# EAGLE design EMS esp32 wifi lora gsm v2.6 (EAGLE 9.5.2)
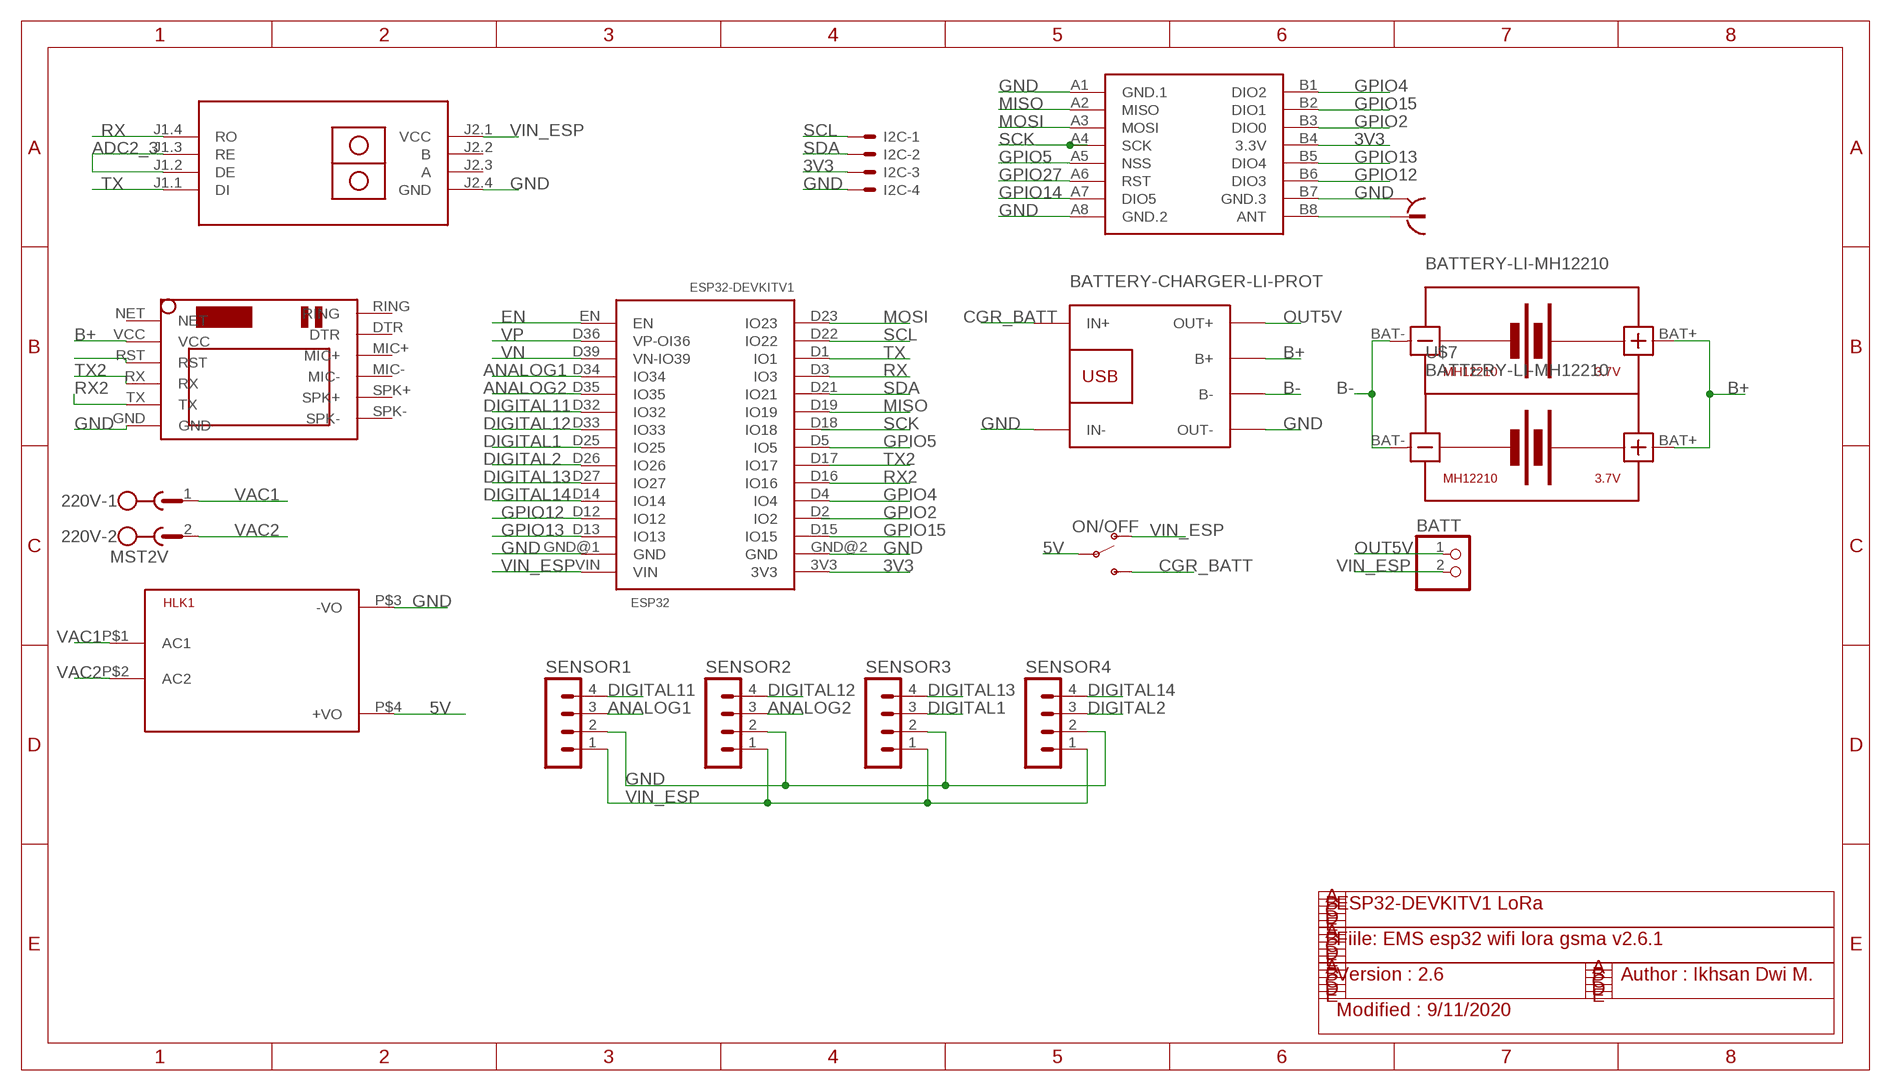
[diagram p0: schematic, sheet 1]

## Parts
220V  MST2V  [MSTBV2]
BATT  PINHD-1X2  [1X02]
ESP32  ESP32DEVKITV1  [ESP32-DEVKITV1]
HLK1  HLK-PM013W  [HLK-PM01]
I2C  22-23-2041  [22-23-2041]
ON/OFF  SWITCH-SPDT-PTH-11.6X4.0MM  [SWITCH_SPDT_PTH_11.6X4.0MM]
SENSOR1  MA04-1  [MA04-1]
SENSOR2  MA04-1  [MA04-1]
SENSOR3  MA04-1  [MA04-1]
SENSOR4  MA04-1  [MA04-1]
U$1  RS485-TTL-CONVERTER  [RS485-TTL-CONVERTER]
U$5  WIRELESS-LORA-RFM95W#SMD  [WIRELESS-LORA-RFM95W#SMD]
U$6  BATTERY-LI-MH12210  [BATTERY-LI-MH12210]
U$7  BATTERY-LI-MH12210  [BATTERY-LI-MH12210]
U$8  BATTERY-CHARGER-LI-PROT  [BATTERY-CHARGER-LI-PROT]
U$9  SIM800LMODULE  [SIM800LMODULE]
X1  734120110  [734120110]

## Nets
3V3: ESP32.3V3 I2C.3 U$5.B4(3.3V)
5V [usbvcc]: HLK1.P$4(+VO) ON/OFF.2(P)
ADC2_3: U$1.J1.2(DE) U$1.J1.3(RE)
ANALOG1: ESP32.D34(IO34) SENSOR1.3
ANALOG2: ESP32.D35(IO35) SENSOR2.3
B+: U$6.BAT+ U$7.BAT+ U$8.B+ U$9.VCC
B-: U$6.BAT- U$7.BAT- U$8.B-
CGR_BATT [usbvcc]: ON/OFF.3(S) U$8.IN+
DIGITAL1: ESP32.D25(IO25) SENSOR3.3
DIGITAL2: ESP32.D26(IO26) SENSOR4.3
DIGITAL11: ESP32.D32(IO32) SENSOR1.4
DIGITAL12: ESP32.D33(IO33) SENSOR2.4
DIGITAL13: ESP32.D27(IO27) SENSOR3.4
DIGITAL14: ESP32.D14(IO14) SENSOR4.4
EN: ESP32.EN
GND: ESP32.GND@1(GND) ESP32.GND@2(GND) HLK1.P$3(-VO) I2C.4 SENSOR1.2 SENSOR2.2 SENSOR3.2 SENSOR4.2 U$1.J2.4(GND) U$5.A1(GND.1) U$5.A8(GND.2) U$5.B7(GND.3) U$8.IN- U$8.OUT- U$9.GND X1.S@1 X1.S@2 X1.S@3
GPIO2: ESP32.D2(IO2) U$5.B3(DIO0)
GPIO4: ESP32.D4(IO4) U$5.B1(DIO2)
GPIO5: ESP32.D5(IO5) U$5.A5(NSS)
GPIO12: ESP32.D12(IO12) U$5.B6(DIO3)
GPIO13: ESP32.D13(IO13) U$5.B5(DIO4)
GPIO14: U$5.A7(DIO5)
GPIO15: ESP32.D15(IO15) U$5.B2(DIO1)
GPIO27: U$5.A6(RST)
MISO: ESP32.D19(IO19) U$5.A2(MISO)
MOSI: ESP32.D23(IO23) U$5.A3(MOSI)
N$2: U$9.RST
N$8: U$5.B8(ANT) X1.1
OUT5V [usbvcc]: BATT.1 U$8.OUT+
RX: ESP32.D3(IO3) U$1.J1.4(RO)
RX2: ESP32.D16(IO16) U$9.TX
SCK: ESP32.D18(IO18) U$5.A4(SCK)
SCL: ESP32.D22(IO22) I2C.1
SDA: ESP32.D21(IO21) I2C.2
TX: ESP32.D1(IO1) U$1.J1.1(DI)
TX2: ESP32.D17(IO17) U$9.RX
VAC1: 220V.1 HLK1.P$1(AC1)
VAC2: 220V.2 HLK1.P$2(AC2)
VIN_ESP [usbvcc]: BATT.2 ESP32.VIN ON/OFF.1(O) SENSOR1.1 SENSOR2.1 SENSOR3.1 SENSOR4.1 U$1.J2.1(VCC)
VN: ESP32.D39(VN-IO39)
VP: ESP32.D36(VP-OI36)
Unconnected: U$1.J2.2(B) U$1.J2.3(A) U$9.DTR U$9.MIC+ U$9.MIC- U$9.NET U$9.RING U$9.SPK+ U$9.SPK-

## Notes on the sheet
- ESP32-DEVKITV1 LoRa
- Fiile: EMS esp32 wifi lora gsma v2.6.1
- Version : 2.6 | Author : Ikhsan Dwi M.
- Modified : 9/11/2020

## Library data of the parts
220V = con-phoenix-508:MST2V: PHOENIX; OC_FARNELL: unknown; OC_NEWARK: unknown
BATT = pinhead:PINHD-1X2: PIN HEADER
ESP32 = ESP32-DEVKITV1:ESP32DEVKITV1
HLK1 = HLK-PM01:HLK-PM01: Hi-Link Power Supply HLK-PM01 3W Author: Ahmed Said <https://github.com/AhmedSaid/EAGLELibraries>
I2C = con-molex:22-23-2041: .100" (2.54mm) Center Header - 4 Pin; MF: MOLEX; MPN: 22-23-2041; OC_FARNELL: 1462920; OC_NEWARK: 38C0355
ON/OFF = SparkFun-Switches:SWITCH-SPDT: Single Pole, Double Throw (SPDT) Switch Single-pole, double-throw (SPDT) switch. Variant Overview SMD-AYZ0202 Surface Mount DPDT Switch <https://www.sparkfun.com/products/597> (COM-00597) Used on e.g. LilyPad Arduino USB - ATmega32U4 Board <https://www.sparkfun.com/products/12049> PTH-11.6X4.0MM SPDT Mini Power Switch <https://www.sparkfun.com/products/102> (COM-00102) Used on e.g. SparkFun Simon Says - Through-Hole Soldering Kit <https://www.sparkfun.com/products/10547> (KIT-10547) PTH-11.6X4.0MM-KIT KIT version of SPDT Mini Power Switch - Simplifies soldering by removing tStop of switch pins - only one side can be soldered. PTH-11.6X4.0MM-LOCK LOCK version of SPDT Mini Power Switch - Offset pins hold switch in place for easier soldering. SMD-RIGHT-ANGLE Surface Mount Right Angle Switch <https://www.sparkfun.com/products/10860> (COM-10860) Used on e.g. SparkFun ESP8266 Thing <https://www.sparkfun.com/products/13231>; PROD_ID: SWCH-08261; SF_SKU: COM-00102
SENSOR1-SENSOR4 = con-lstb:MA04-1: PIN HEADER; OC_FARNELL: unknown; OC_NEWARK: unknown
U$1 = diy-modules:RS485-TTL-CONVERTER: RS485 to TTL converter based on MAX485 chip
U$5 = diy-modules:WIRELESS-LORA-RFM95W: 868/915 MHz LoRa Radio Transceiver Module based on SX1276 chip Click here to find device on ebay.com <http://www.ebay.com/sch/RFM95W+transceiver>
U$6 U$7 = diy-modules:BATTERY-LI-MH12210: Lithium-Ion MH12210 Rechargeable Battery Panasonic NCR18650PF battery datasheet available here: https://industrial.panasonic.com/cdbs/www-data/pdf2/ACI4000/ACI4000C12.pdf Click here to find device on ebay.com <http://www.ebay.com/sch/ncr18650b+battery>
U$8 = diy-modules:BATTERY-CHARGER-LI-PROT: Lithium Battery 5V Charger with protection circuit More details available here: http://www.instructables.com/id/DIY-Lithium-ion-Battery-Charger/step4/TP4056-based-lithium-ion-battery-charger-module/ Click here to find device on ebay.com <http://www.ebay.com/sch/tp4056+charger+usb+protection>
U$9 = SIM800LMODULE:SIM800LMODULE: SIM800L Module
X1 = con-coax:734120110: MICRO COAXIAL CONNECTOR RECEPTACLE VERTICAL Source: Data sheet <http://www.molex.com/pdm_docs/sd/734120110_sd.pdf>

## Net classes
1 power: width 0.61 mm, drill 0.508 mm, clearance 0.152 mm
2 gnd: width 0.305 mm, drill 0.508 mm, clearance 0.152 mm
3 usbvcc: width 0.508 mm, drill 0.508 mm, clearance 0.152 mm

## Board
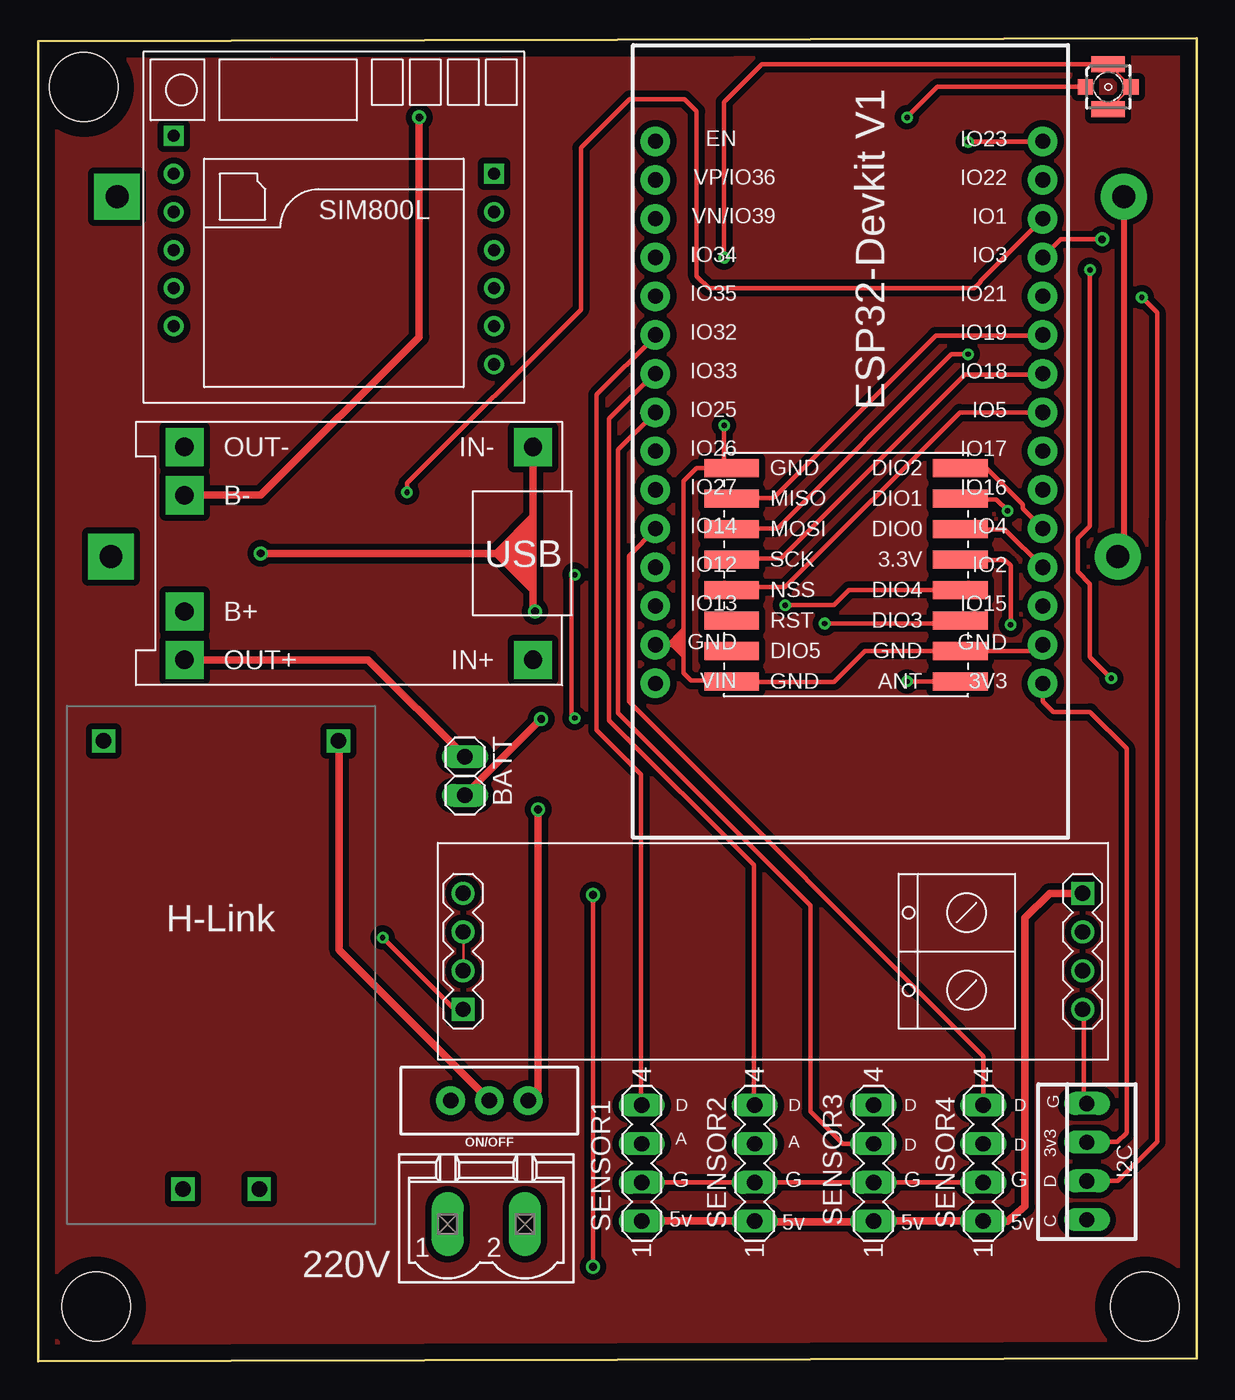
[diagram p1: board, top side]
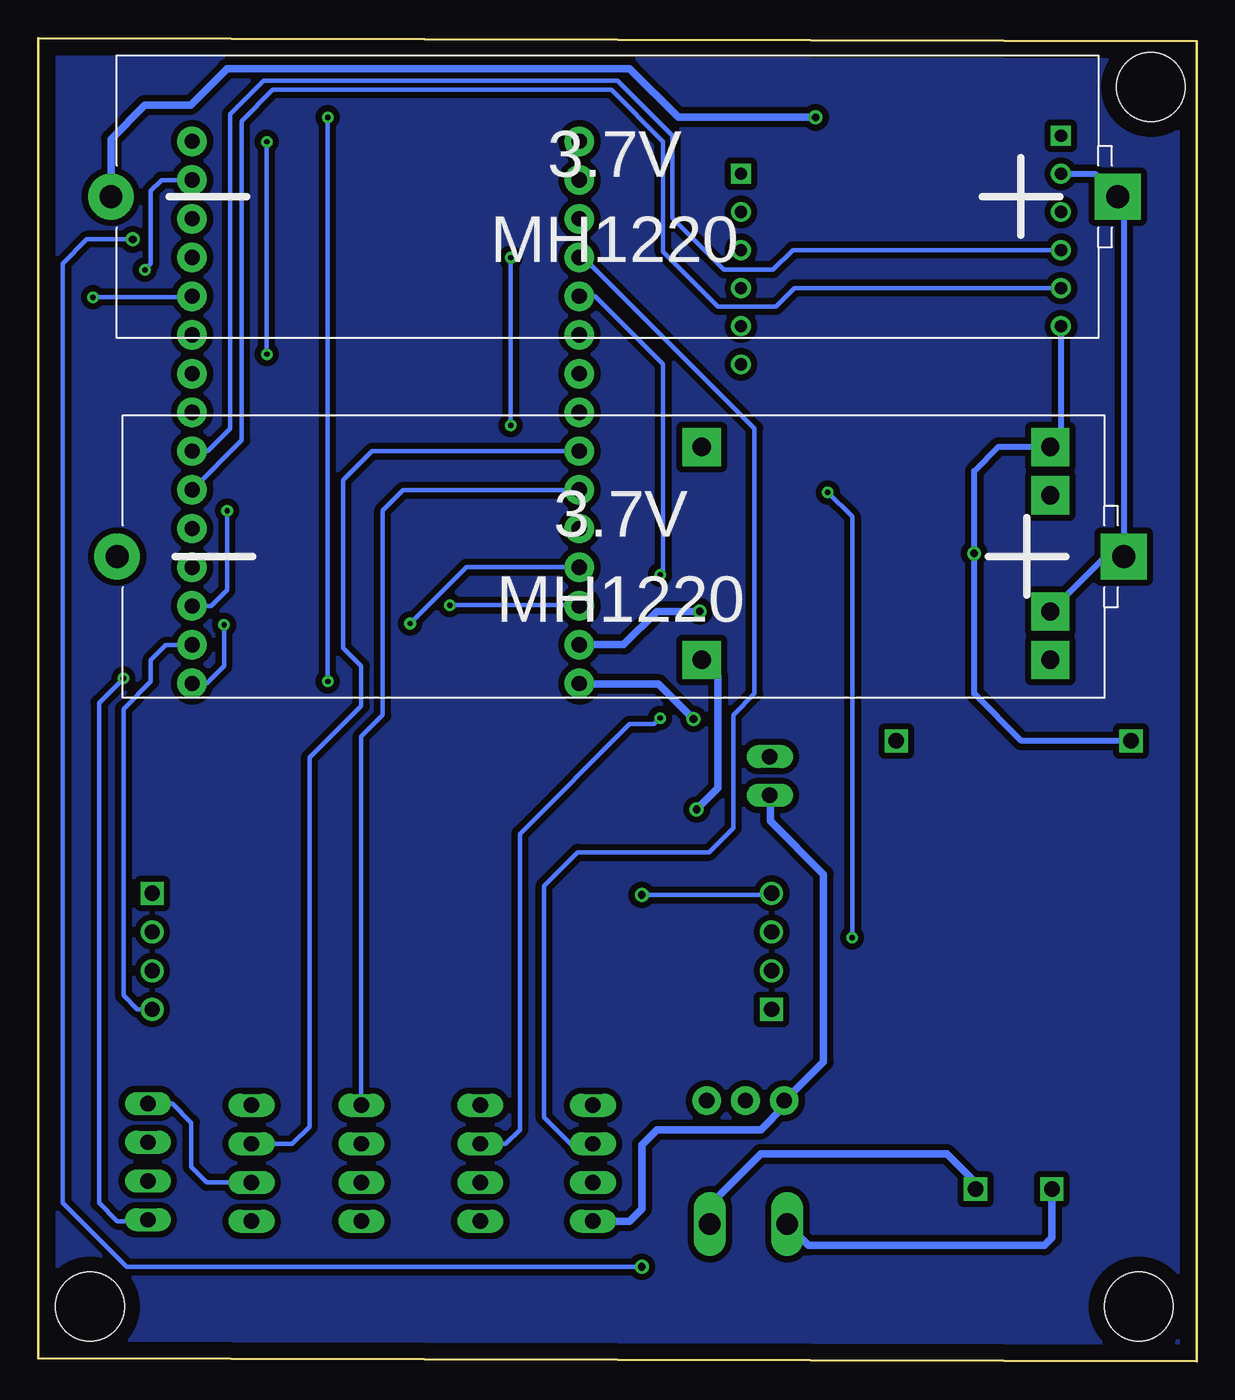
[diagram p2: board, bottom side, seen from below]

Size 76 x 86.8 mm. Coordinates in mm from the lower left corner, seen from the top.
Outline: 0,86.6 76,86.8 76,0.2 0,0 0,86.6
Copper layers (1*16): Top 0.035mm / dielectric 1.5mm / Bottom 0.035mm
Design rules "default": minimum track width 6mil, minimum drill 0.35mm, track to track 6mil, track to pad 6mil, pad to pad 6mil, via to via 6mil, smd to smd 6mil, copper to edge 40mil, drill to drill 6mil, minimum pad ring 10mil, minimum via ring 8mil, stop-mask expansion 4mil, vias tented up to drill 0mil, thermal gap 10mil
Holes 4.5 mm at 3.8,3.6 72.6,3.6 3,83.6

### Footprints (pad centres in the part's own frame; a part is rotated, then mirrored left to right if it is on the bottom)
MSTBV2 = drill 1.397 long: 1 -2.54,0; 2 2.54,0
1X02 = drill 1.016 long: 1 -1.27,0; 2 1.27,0
ESP32-DEVKITV1 = drill 1 pad 1.93: 3V3 -16.52,-12.27; D1 13.96,-12.27; D2 -8.9,-12.27; D3 11.42,-12.27; D4 -6.36,-12.27; D5 1.26,-12.27; D12 -8.9,13.135; D13 -11.44,13.135; D14 -6.36,13.135; D15 -11.44,-12.27; D16 -3.82,-12.27; D17 -1.28,-12.27; D18 3.8,-12.27; D19 6.34,-12.27; D21 8.88,-12.27; D22 16.5,-12.27; D23 19.04,-12.27; D25 1.26,13.135; D26 -1.28,13.135; D27 -3.82,13.135; D32 6.34,13.135; D33 3.8,13.135; D34 11.42,13.135; D35 8.88,13.135; D36 16.5,13.135; D39 13.96,13.135; EN 19.04,13.135; GND@1 -13.98,13.135; GND@2 -13.98,-12.27; VIN -16.52,13.135
HLK-PM01 = drill 1.016 square: P$1 -14.7,2.5; P$2 -14.7,-2.5; P$3 14.7,7.7; P$4 14.7,-7.7
22-23-2041 = drill 1 long: 1 -3.81,0; 2 -1.27,0; 3 1.27,0; 4 3.81,0
SWITCH_SPDT_PTH_11.6X4.0MM = drill 1.016 pad 1.88: 1 0,2.54; 2 0,0; 3 0,-2.54
MA04-1 = drill 1.016 long: 1 -3.81,0; 2 -1.27,0; 3 1.27,0; 4 3.81,0
RS485-TTL-CONVERTER = drill 1 square: J1.1 -20.32,-3.81; J2.1 20.32,3.81 | drill 1: J1.2 -20.32,-1.27; J1.3 -20.32,1.27; J1.4 -20.32,3.81; J2.2 20.32,1.27; J2.3 20.32,-1.27; J2.4 20.32,-3.81
WIRELESS-LORA-RFM95W#SMD = smd 3.6 x 1.2: A1 -7.5,7; A2 -7.5,5; A3 -7.5,3; A4 -7.5,1; A5 -7.5,-1; A6 -7.5,-3; A7 -7.5,-5; A8 -7.5,-7; B1 7.5,7; B2 7.5,5; B3 7.5,3; B4 7.5,1; B5 7.5,-1; B6 7.5,-3; B7 7.5,-5; B8 7.5,-7
BATTERY-LI-MH12210 = drill 1.5 pad 3 square: BAT+ -33.02,0 | drill 1.5 pad 3: BAT- 33.02,0
BATTERY-CHARGER-LI-PROT = drill 1.2 pad 2.5 square: B+ 10.795,3.81; B- 10.795,-3.81; IN+ -12.065,6.985; IN- -12.065,-6.985; OUT+ 10.795,6.985; OUT- 10.795,-6.985
SIM800LMODULE = drill 0.8: DTR 10.5,1; GND -10.5,-6.5; MIC+ 10.5,-1.5; MIC- 10.5,-4; RST -10.5,1; RX -10.5,-1.5; SPK+ 10.5,-6.5; SPK- 10.5,-9; TX -10.5,-4; VCC -10.5,3.5 | drill 0.8 square: NET -10.5,6; RING 10.5,3.5
734120110 = smd 1 x 1: 1 0,-1.5; S@1 0,1.5 | smd 1.05 x 2.2: S@2 -1.475,0; S@3 1.475,0

### Placement (x,y rotation side)
220V  29.4,9 0 top
BATT  28,38.4 270 top
ESP32  53.63,60.99 90 top
HLK1  12,26 90 top
I2C  68.8,13.1 90 top
ON/OFF  29.6,17.1 90 top
SENSOR1  39.6,13 90 top
SENSOR2  47,13 90 top
SENSOR3  54.8,13 90 top
SENSOR4  62,13 90 top
U$1  48.2,26.9 0 top
U$5  53,51.6 0 top
U$6  37.8,52.8 180 bottom
U$7  38.2,76.4 180 bottom
U$8  20.4,53 180 top
U$9  19.4,74.4 0 top
X1  70.2,83.6 270 top

### Tracks (layer width: path | path; a pad name or v marks a point on that pad's centre or on a via)
3V3  (via drill 0.35)
  Top 0.152: 65.87,44.54 ESP32.3V3 | 68.82,14.4 I2C.3 | 60.8,52.58 60.51,52.58 U$5.B4
  Top 0.305: v63.8,48.31 63.8,52.2 63.42,52.58 60.8,52.58 | ESP32.3V3 65.9,43.3 66.6,42.6 69,42.6 71.4,40.2 71.4,15 70.8,14.4 68.82,14.4
  Bottom 0.305: ESP32.3V3 64.93,44.47 63.8,45.6 v63.8,48.31
5V
  Top 0.508: HLK1.P$4 19.75,40.69 19.75,26.98 29.58,17.15 ON/OFF.2
ADC2_3
  Top 0.152: U$1.J1.2 27.9,25.68 27.9,28.12 U$1.J1.3
ANALOG1
  Top 0.152: 40.42,72.43 ESP32.D34
  Bottom 0.305: SENSOR1.3 40.93,14.27 41,14.2 42.8,16 42.8,31.2 40.6,33.4 32,33.4 30.4,35 30.4,42.4 29,43.8 29,61.2 40.21,72.41 ESP32.D34
ANALOG2  (via drill 0.35)
  Top 0.152: 40.42,69.91 ESP32.D35
  Top 0.305: v35.2,42.2 35,42.4 35,51.4 v35.2,51.6
  Bottom 0.305: SENSOR2.3 45.33,14.27 44.4,15.2 44.4,34.6 37.2,41.8 35.6,41.8 v35.2,42.2 | v35.2,51.6 35,51.8 35,65.4 39.47,69.87 ESP32.D35
B
  pour Bottom (isolate 0.406): 0.6,85.8 75.2,85.8 75.2,0.8 0.8,0.8 0.8,85.6
B+
  Bottom 0.406: U$8.B+ 6,52.8 U$6.BAT+ 4.78,76 U$7.BAT+ 6.68,77.9 U$9.VCC
B-  (via drill 0.51)
  Top 0.406: U$7.BAT- 71.22,53.2 U$6.BAT-
  Top 0.508: U$8.B- 14.61,56.81 25,67.2 v25,81.6
  Bottom 0.508: v25,81.6 34,81.6 37.2,84.8 63.6,84.8 66,82.4 69,82.4 71.22,80.18 U$7.BAT-
CGR_BATT  (via drill 0.51)
  Top 0.508: v32.8,36.2 32.8,17.76 ON/OFF.3
  Bottom 0.508: U$8.IN+ 31.4,44.95 31.4,37.6 v32.8,36.2
DIGITAL1
  Top 0.152: 40.42,62.29 ESP32.D25 | 52.8,14.27 52.76,14.27 52.71,14.31 50.65,16.38 50.65,16.4 | 38.04,42.6 38.04,42.52
  Top 0.305: 39.6,62.2 40.45,62.2 ESP32.D25 38.04,59.8 38.04,42.6 | 38.04,42.52 50.65,29.91 50.65,16.4 52.76,14.29 52.76,14.27 | 52.8,14.27 SENSOR3.3
DIGITAL2
  Top 0.152: 40.42,59.78 ESP32.D26
  Bottom 0.305: SENSOR4.3 59.33,14.27 58.2,15.4 58.2,39.6 54.8,43 54.8,45.6 56,46.8 56,57.8 54.09,59.71 ESP32.D26
DIGITAL11
  Top 0.152: 40.42,67.4 ESP32.D32 | 39.56,16.84 SENSOR1.4
  Top 0.305: ESP32.D32 40.5,67.26 36.63,63.4 36.63,41.42 39.56,38.49 39.56,16.84
DIGITAL12
  Top 0.152: 40.42,64.81 ESP32.D33 40.4,64.77
  Top 0.305: SENSOR2.4 46.95,16.86 46.95,32.56 37.45,42.05 37.45,61.83 40.4,64.77
DIGITAL13
  Top 0.152: 40.42,57.19 ESP32.D27
  Bottom 0.152: 40.55,57.15 ESP32.D27
  Bottom 0.305: 40.55,57.15 52.05,57.15 53.4,55.8 53.4,42.4 54.8,41 SENSOR3.4
DIGITAL14
  Top 0.152: 40.42,54.67 ESP32.D14 | 38.75,43.27 38.81,43.21
  Top 0.305: ESP32.D14 40.5,54.58 38.75,52.84 38.75,43.27 | 38.81,43.21 62,20.02 SENSOR4.4
EN
  Top 0.152: 40.42,80.05 ESP32.EN
GND  (via drill 0.35, 0.51)
  Top 0.152: 40.42,47.05 ESP32.GND@1 | SENSOR2.2 | 68.59,23.09 U$1.J2.4 | 55,11.74 54.87,11.74 SENSOR3.2 | 44.4,44.65 45.43,44.65 U$5.A8 45.58,44.58 45.8,44.58 | X1.S@2 70.27,85.04 71.64,83.67 X1.S@1 71.71,83.59 70.27,82.14 X1.S@3 | 65.92,47.02 ESP32.GND@2 65.86,46.95 65.85,46.94 | 60.51,46.63 U$5.B7
  Top 0.305: 45.8,44.58 52.2,44.58 54.22,46.6 U$5.B7 65.5,46.6 65.86,46.95 | 42.2,46.4 41.6,47 ESP32.GND@1 41.35,47.01 41.47,47.13 | 42.2,46.4 42.34,46.26 | 42.34,46.26 42.34,45.14 42.83,44.65 44.4,44.65 | U$5.A1 45.2,58.6 | 45.2,58.6 43.2,58.6 42.34,57.74 42.34,48 | 42.34,48 42.34,47.2 | 42.34,47.2 42.34,46.26 | 41.47,47.13 42.07,47.73 | 42.07,47.73 42.34,48 | 41.47,47.13 41.8,47.13 | 41.8,47.13 42.27,47.13 42.34,47.2 | 42.07,47.73 42.2,47.6 42.2,47.4 | 42.2,47.4 42.2,46.73 | 42.2,46.73 42.2,46.4 | 41.8,47.13 42.07,47.4 42.2,47.4 | 41.8,47.13 42.2,46.73 | X1.S@2 47.48,85.07 45,82.6 v45,72.4 | v45,61.4 45,58.8 45.2,58.6 | I2C.4 68.59,17.12 68.59,23.09 | SENSOR4.2 55.01,11.73 55,11.74 | SENSOR3.2 SENSOR2.2 | SENSOR1.2 SENSOR2.2
  Top 0.508: 31.98,59.99 U$8.IN- 32.47,55.4 | 32.47,55.4 32.47,54.8 | 32.47,54.8 32.47,54.2 | 32.47,54.2 32.47,53.6 | 32.47,53.6 32.47,53 | 32.47,53 32.47,52.4 | 32.47,52.4 32.47,51.8 | 32.47,51.8 32.47,51.2 | 32.47,51.2 32.47,50.6 | 32.47,50.6 32.47,49.34 v32.6,49.2 | v14.6,53 30.2,53 | 32.47,53 31.8,53 | 31.8,53 31.26,53 | 30.67,53 31.2,53 | 32.47,54.8 30.67,53 | 30.67,53 30.2,53 | 32.47,55.4 30.2,53.13 30.2,53 | 30.2,53 30.2,52.87 32.47,50.6 | 30.67,53 32.47,51.2 | 31.2,53 32.4,51.8 32.47,51.8 | 31.8,53 32.4,52.4 32.47,52.4 | 31.2,53 31.26,53 | 31.26,53 32.47,54.2 | 31.8,53 32.4,53.6 32.47,53.6
  Bottom 0.152: 65.87,46.98 ESP32.GND@2 65.92,46.94
  Bottom 0.305: v45,72.4 v45,61.4 | I2C.4 67.21,16.91 65.95,15.65 65.95,12.75 64.93,11.73 SENSOR4.2 | U$1.J2.4 69.49,23.09 70.4,24 70.4,42.8 68.6,44.6 68.6,46 67.62,46.98 65.87,46.98
  Bottom 0.406: U$9.GND 8.9,60.69 U$8.OUT- | U$8.OUT- | HLK1.P$3 11.5,40.7 14.6,43.8 v14.6,53 14.6,58.4 13,59.99 U$8.OUT-
  Bottom 0.508: v32.6,49.2 35.4,49.2 37.59,47.01 ESP32.GND@1
GPIO2
  Top 0.152: 62,54.56 60.51,54.56 U$5.B3
  Top 0.305: ESP32.D2 63.43,54.56 62,54.56
GPIO4
  Top 0.305: ESP32.D4 64.6,55.93 64.6,56.2 62.2,58.6 U$5.B1
GPIO5
  Top 0.305: U$5.A5 45.7,50.8 49,50.8 60.45,62.25 ESP32.D5
GPIO12  (via drill 0.35)
  Top 0.152: 40.42,52.16 ESP32.D12
  Top 0.305: U$5.B6 60.3,48.4 v51.6,48.4
  Bottom 0.305: v51.6,48.4 47.91,52.09 ESP32.D12
GPIO13  (via drill 0.35)
  Top 0.152: 40.42,49.57 ESP32.D13
  Top 0.305: U$5.B5 53.2,50.6 52.2,49.6 v49,49.6
  Bottom 0.305: v49,49.6 40.55,49.6 ESP32.D13
GPIO15  (via drill 0.35)
  Top 0.152: 62.27,56.54 61.6,56.54 60.51,56.54 U$5.B2
  Top 0.305: v63.6,55.8 62.86,56.54 61.6,56.54
  Bottom 0.305: ESP32.D15 64.65,49.55 63.6,50.6 v63.6,55.8
MISO
  Top 0.152: 48.22,56.62 48.3,56.7
  Top 0.305: ESP32.D19 65.86,67.28 58.89,67.28 48.3,56.7 | U$5.A2 45.52,56.62 48.22,56.62
MOSI  (via drill 0.35)
  Top 0.152: 65.95,80.05 ESP32.D23 66,80.01 | 48.4,54.64 48.49,54.64 48.53,54.67
  Top 0.305: U$5.A3 45.54,54.64 48.4,54.64 | 48.53,54.67 59.92,66.07 v61,66.07 | v61,80 65.99,80 66,80.01
  Bottom 0.305: v61,66.07 v61,80
N$8  (via drill 0.35)
  Top 0.152: 60.51,44.65 U$5.B8
  Top 0.305: U$5.B8 v57,44.6 | v57,81.6 59,83.6 X1.1
  Bottom 0.305: v57,44.6 v57,81.6
OUT5V
  Top 0.508: BATT.1 21.65,46.02 U$8.OUT+
RX  (via drill 0.51)
  Top 0.152: 65.95,72.43 ESP32.D3
  Top 0.305: ESP32.D3 67.09,73.6 v69.8,73.6 | v36.4,6.2 v36.4,30.6
  Bottom 0.305: v69.8,73.6 72.8,73.6 74.4,72 74.4,10.4 70.2,6.2 v36.4,6.2 | v36.4,30.6 27.99,30.6 U$1.J1.4
RX2
  Bottom 0.152: 8.93,70.33 U$9.TX
  Bottom 0.305: U$9.TX 26.4,70.4 27.6,69.2 31.4,69.2 35,72.8 35,80 38.4,83.4 60.6,83.4 62.64,81.36 62.64,60.43 ESP32.D16
SCK
  Top 0.152: 46,52.66 45.5,52.66 U$5.A4
  Top 0.305: ESP32.D18 65.85,64.74 60.8,64.74 48.71,52.66 46,52.66
SCL  (via drill 0.35)
  Top 0.152: 65.95,77.53 ESP32.D22
  Top 0.305: v69,71.6 69,54.8 68.2,54 68.2,51.8 69,51 69,46.2 v70.4,44.8
  Bottom 0.152: 68.82,9.68 68.82,9.3 I2C.1
  Bottom 0.305: ESP32.D22 67.91,77.49 68.6,76.8 68.6,72 v69,71.6 | v70.4,44.8 72,43.2 72,10.4 70.8,9.2 68.89,9.2 I2C.1
SDA  (via drill 0.35)
  Top 0.152: 65.95,69.91 ESP32.D21
  Top 0.305: I2C.2 70.83,11.83 73.4,14.4 73.4,55 73.4,55.2 73.4,68.8 v72.4,69.8
  Bottom 0.152: 68.82,12.19 68.82,11.89 I2C.2 | 65.92,69.8 ESP32.D21
  Bottom 0.305: ESP32.D21 65.97,69.8 v72.4,69.8
T
  pour Top (isolate 0.406): 0.6,86 75.2,86 75.2,1 1,1 1,85.6
TX  (via drill 0.35)
  Top 0.152: 65.95,74.94 ESP32.D1
  Top 0.305: ESP32.D1 61.8,70.85 61.8,70.8 61.4,70.4 44,70.4 43.2,71.2 43.2,82 42.4,82.8 38.8,82.8 35.6,79.6 35.6,69 24.2,57.6 v24.2,57 | U$1.J1.1 27.31,23.09 v22.6,27.8
  Bottom 0.305: v24.2,57 22.6,55.4 v22.6,27.8
TX2
  Bottom 0.152: 65.85,59.74 ESP32.D17
  Bottom 0.305: U$9.RX 26.5,72.9 27.8,71.6 31,71.6 34.4,75 34.4,80.4 38,84 61.2,84 63.4,81.8 63.4,61.2 64.89,59.71 ESP32.D17
VAC1
  Bottom 0.508: HLK1.P$1 9.5,8.1 10,7.6 25.46,7.6 220V.1
VAC2
  Bottom 0.508: 220V.2 31.94,10.26 28.6,13.6 16.4,13.6 14.5,11.7 HLK1.P$2
VIN_ESP  (via drill 0.51)
  Top 0.508: v33.01,42.14 28.05,37.19 BATT.2 | SENSOR1.1 39.63,9.22 46.95,9.22 SENSOR2.1 47.25,9.14 54.57,9.14 SENSOR3.1 54.87,9.22 61.81,9.22 SENSOR4.1 63.59,9.19 64.74,10.16 64.74,29.1 66.35,30.71 U$1.J2.1
  Bottom 0.508: BATT.2 27.97,37.11 27.97,35.45 24.48,31.96 24.48,19.65 26.98,17.15 ON/OFF.1 27.06,16.74 28.6,15.2 35.4,15.2 36.4,14.2 36.4,10 37.21,9.19 SENSOR1.1 | v33.01,42.14 35.29,44.43 40.47,44.43 ESP32.VIN
VN
  Top 0.152: 40.42,75.02 ESP32.D39
VP
  Top 0.152: 40.42,77.53 ESP32.D36

### Text on the board
tPlace: H-Link | D | D | D | D | G | A | A | D | D | 3v3 | G | G | G | G | D | 5v | 5v | 5v | 5v | C